# Altium project Hardware_Inventors_Course_Project.PrjPcb (part 2 of 2)

## Sheet 05_Sensors.SchDoc
size A4; SheetNumber: 5; SheetTotal: 9
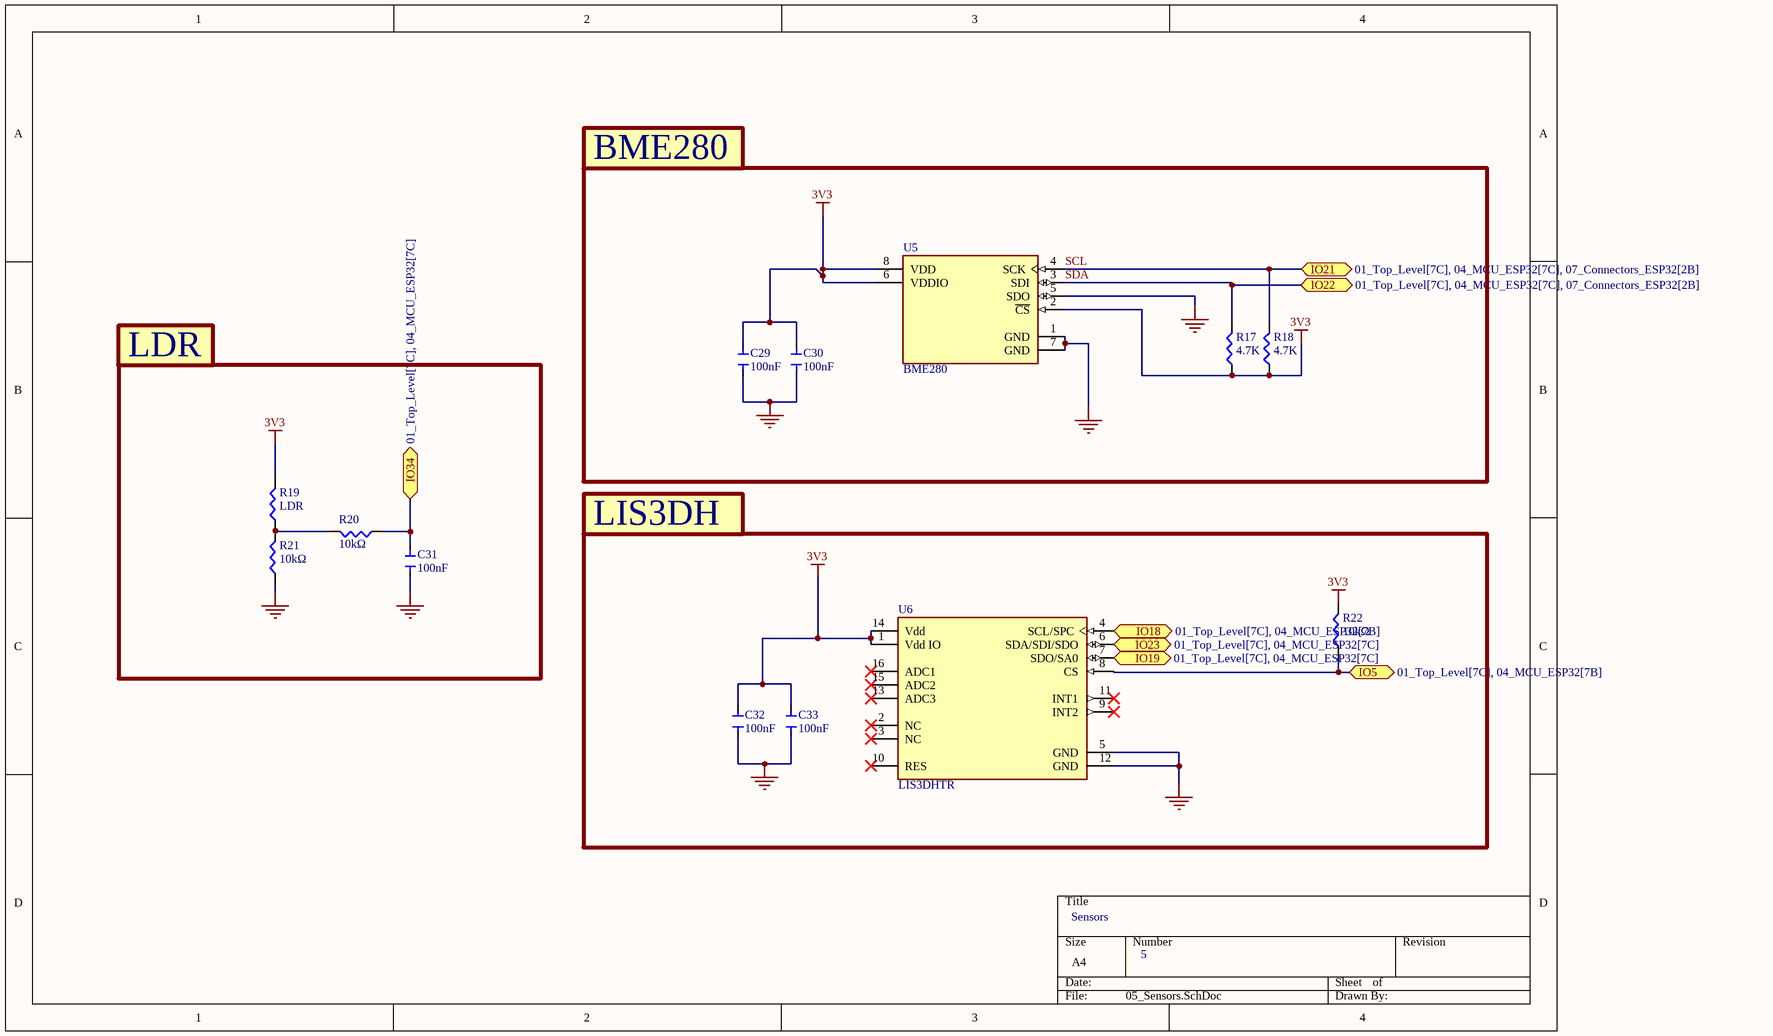
[diagram p4: 05_Sensors.SchDoc]

### Parts
C29  100nF  [CAP_100nF]
C30  100nF  [CAP_100nF]
C31  100nF  [CAP_100nF]
C32  100nF  [CAP_100nF]
C33  100nF  [CAP_100nF]
R17  4.7K  [RES_2K]
R18  4.7K  [RES_2K]
R19  LDR  [RES_2K]
R20  10kΩ  [RES_10K]
R21  10kΩ  [RES_10K]
R22  10kΩ  [RES_10K]
U5  BME280  [FP-BME280-MFG]
U6  LIS3DHTR  [FP-LGA-16-7983231-MFG]

### Blocks framed on the sheet
BME280: C29 C30 R17 R18 U5
LDR: C31 R19-R21
LIS3DH: C32 C33 R22 U6

### Ports
IO5 (bidir, see 01_Top_Level[7C], 04_MCU_ESP32[7B]), IO18 (bidir, see 01_Top_Level[7C], 04_MCU_ESP32[7B]), IO19 (bidir, see 01_Top_Level[7C], 04_MCU_ESP32[7C]), IO21 (bidir, see 01_Top_Level[7C], 04_MCU_ESP32[7C], 07_Connectors_ESP32[2B]), IO22 (bidir, see 01_Top_Level[7C], 04_MCU_ESP32[7C], 07_Connectors_ESP32[2B]), IO23 (bidir, see 01_Top_Level[7C], 04_MCU_ESP32[7C]), IO34 (bidir, see 01_Top_Level[7C], 04_MCU_ESP32[7C])

### Nets
3V3: C29.2 C30.2 C32.2 C33.2 R17.1 R18.1 R19.2 R22.2 U5.2(~{CS}) U5.6(VDDIO) U5.8(VDD) U6.1(Vdd_IO) U6.14(Vdd)
GND: C29.1 C30.1 C31.1 C32.1 C33.1 R21.1 U5.1(GND) U5.5(SDO) U5.7(GND) U6.5(GND) U6.12(GND)
SCL: R18.2 U5.4(SCK) ; port IO21
SDA: R17.2 U5.3(SDI) ; port IO22
NetC31_2: C31.2 R20.1 ; port IO34
NetMD1_29: R22.1 U6.8(CS) ; port IO5
NetMD1_30: U6.4(SCL/SPC) ; port IO18
NetMD1_31: U6.7(SDO/SA0) ; port IO19
NetMD1_37: U6.6(SDA/SDI/SDO) ; port IO23
NetR19_1: R19.1 R20.2 R21.2

Not connected (* = marked no-connect by the designer): U6 2(NC)* 3(NC)* 9(INT2)* 10(RES)* 11(INT1)* 13(ADC3)* 15(ADC2)* 16(ADC1)*

### Notes on the sheet
- Sensors
- 5

### Library data of the parts
C29-C33 = CAP_100nF: CAP 100nF 50V X7R ±10% 0603 Ceramic Capacitors RoHS; manufacturer: YAGEO; manufacturer part number: CC0603KRX7R9BB104; value: 100nf; supplier: LCSC; supplier part number: C14663; ComponentLink1Description: Datasheet; ComponentLink1URL: https://www.lcsc.com/datasheet/C14663.pdf
R17-R19 = RSE_0603_2K: 100mW 2KΩ 75V Thick Film Resistor ±100ppm/℃ ±1% 0603 Chip Resistor - Surface Mount RoHS; ComponentLink1Description: datasheet; ComponentLink1URL: https://www.lcsc.com/product-detail/C105588.html?s_z=n_resistance%2520100%2520ohm
R20-R22 = RES_0603_10K: 100mW Thin Film Resistor ±0.1% ±10ppm/℃ 10kΩ 0603 Chip Resistor - Surface Mount ROHS; Manufacturer: Yageo Group; Manufacturer Part Number: RT0603BRB07169KL; Manufacturer: YAGEO; Temperature Coefficient: 10ppm/°C; Voltage Rating: 75V; Features: Moisture Resistant; Height: 450µm; Length: 1.6002mm; Lifecycle Status: Production; Max Operating Temperature: 155°C; Max Power Dissipation: 100mW; Min Operating Temperature: -55°C; Mounting Technology: Surface Mount; Number of Terminals: 2; Number of Terminations: 2; Packaging: Tape & Reel; Power Dissipation: 100mW; Power Rating: 100mW; REACH SVHC: Yes; Tolerance: 0.1%; Width: 800µm; Working Voltage: 75V; ComponentLink1URL: https://datasheet.octopart.com:443/RT0603BRB07169KL-Yageo-datasheet-176402239.pdf?src-supplier=IHS; ComponentLink1Description: https://datasheet.octopart.com:443/RT0603BRB07169KL-Yageo-datasheet-176402239.pdf?src-supplier=IHS; ComponentLink2URL: https://datasheet.octopart.com:443/RT0603BRB07169KL-Yageo-datasheet-96443642.pdf?src-supplier=Upverter; ComponentLink2Description: https://datasheet.octopart.com:443/RT0603BRB07169KL-Yageo-datasheet-96443642.pdf?src-supplier=Upverter; ComponentLink3URL: https://datasheet.octopart.com:443/RT0603BRB07169KL-Yageo-Group-datasheet-141265893.pdf?src-supplier=ODG+(Origin+Data+Global); ComponentLink3Description: https://datasheet.octopart.com:443/RT0603BRB07169KL-Yageo-Group-datasheet-141265893.pdf?src-supplier=ODG+(Origin+Data+Global); ComponentLink4URL: https://datasheet.octopart.com/RT0603BRB07169KL-Yageo-datasheet-86813807.pdf; ComponentLink4Description: https://datasheet.octopart.com/RT0603BRB07169KL-Yageo-datasheet-86813807.pdf; ComponentLink5URL: http://sigma.octopart.com:80/conflict_mineral_statement/Yageo-company-3.pdf?src-supplier=Compliance+Statements; ComponentLink5Description: http://sigma.octopart.com:80/conflict_mineral_statement/Yageo-company-3.pdf?src-supplier=Compliance+Statements; ComponentLink6URL: http://sigma.octopart.com:80/rohs_statement/Yageo-company-2.pdf?src-supplier=Compliance+Statements; ComponentLink6Description: http://sigma.octopart.com:80/rohs_statement/Yageo-company-2.pdf?src-supplier=Compliance+Statements; Supplier: LCSC; Supplier Part Number: C860143; Datasheet Link: https://www.lcsc.com/datasheet/C860143.pdf
U5 = CMP-2000-05073-3: SENSOR PRESSURE HUMIDITY TEMP; Sensor Type: Temperature; Accuracy: 3%; Response Time: 1s; Output Type: SPI; Min Operating Temperature: -40°C; Max Operating Temperature: 85°C; Case/Package: LGA; Packaging: Cut Tape; Mount: Surface Mount; Lead Free: Lead Free; Number of Pins: 8
U6 = CMP-0234-00055-6: ACCEL 2-16G I2C/SPI 16LGA; Max Supply Voltage: 3.6V; Bandwidth: 5kHz; Min Supply Voltage (DC): 1.71V; Interface: I2C; Axis: X, Y, Z; Operating Supply Voltage: 2.5V; Operating Supply Current: 11uA; Output Type: Digital; Resolution: 16b; Sensor Type: 3 Axis; Series: -; Package Quantity: 1; Case/Package: LGA; Radiation Hardening: No; Min Operating Temperature: -40°C; Length: 3mm; Max Supply Voltage (DC): 3.6V; Lead Free: Lead Free; Height: 1mm; Number of Pins: 16; RoHS Compliant: Yes; Packaging: Tape and Reel; Width: 3mm; Contact Plating: Gold; Max Operating Temperature: 85°C; Min Supply Voltage: 1.71V; REACH SVHC: No SVHC; Depth: 3mm

## Sheet 06_Analog_and_Motor.SchDoc
size A; SheetNumber: 6; SheetTotal: 9
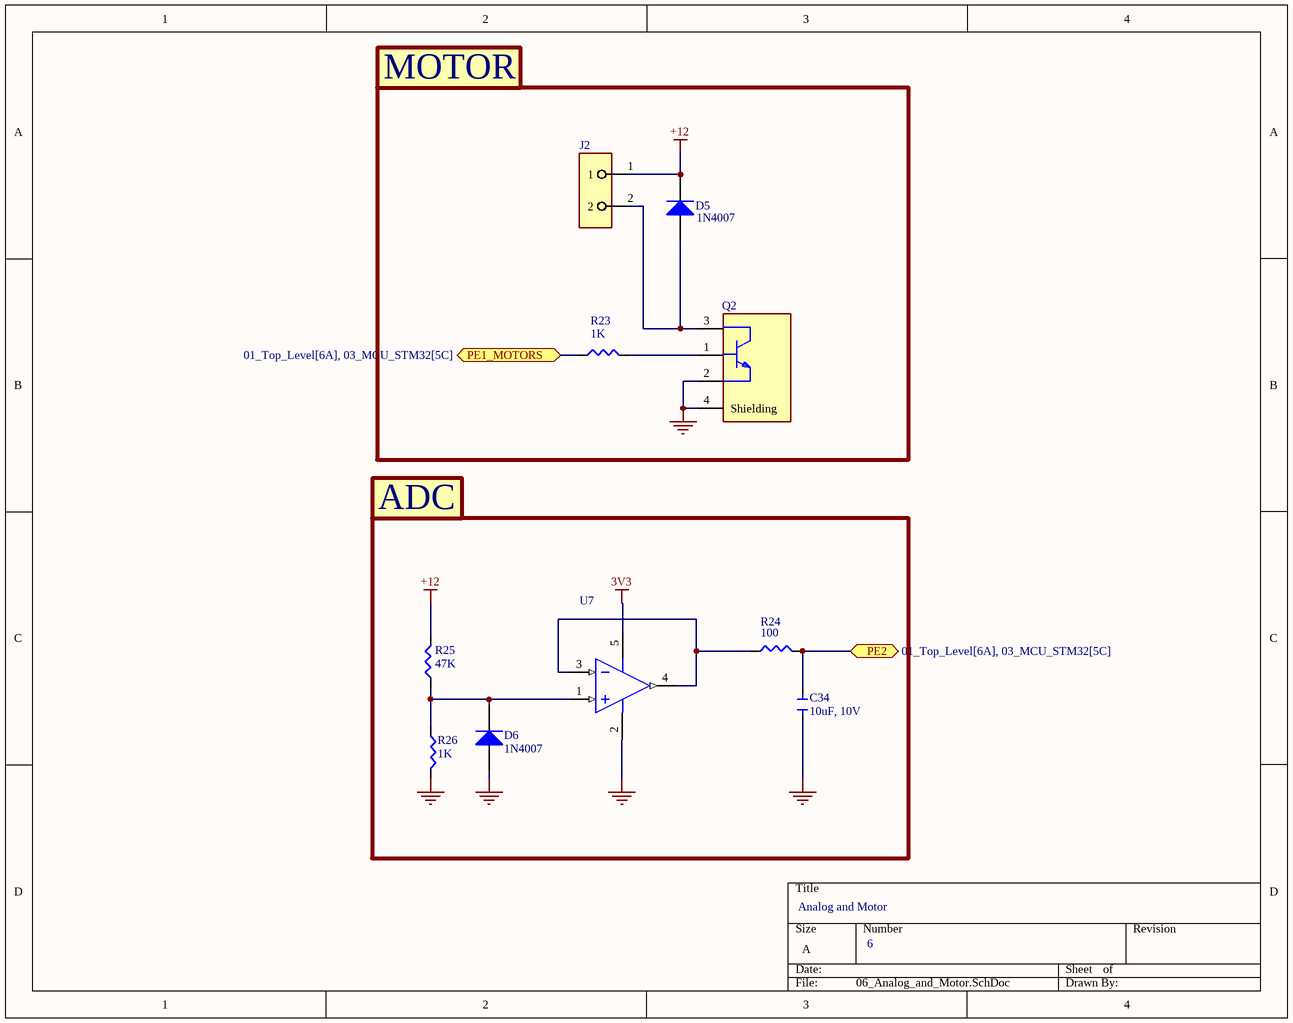
[diagram p5: 06_Analog_and_Motor.SchDoc]

### Parts
C34  10uF, 10V  [CAP_10uF]
D5  1N4007  [FAIR-DO-41-2]
D6  1N4007  [FAIR-DO-41-2]
J2  43640-0201  [FP-43640-0201-MFG]  (value not drawn)
Q2  JANTX2N2222AUB/TR  [FP-UB-IPC_A]  (value not drawn)
R23  1K  [RES_2K]
R24  100  [RES_2K]
R25  47K  [RES_2K]
R26  1K  [RES_2K]
U7  LMV321SN3T1G  [ONSC-TSOP-5-483-02_V]  (value not drawn)

### Blocks framed on the sheet
MOTOR: D5 J2 Q2 R23
ADC: C34 D6 R24-R26 U7

### Ports
PE1_MOTORS (bidir, see 01_Top_Level[6A], 03_MCU_STM32[5C]), PE2 (bidir, see 01_Top_Level[6A], 03_MCU_STM32[5C])

### Nets
3V3: U7.5(V+)
+12: D5.1(K) J2.1 R25.2
GND: C34.1 D6.2(A) Q2.2(E) Q2.4(Shielding) R26.2 U7.2(V-)
PE1_MOTORS: R23.1 ; port PE1_MOTORS
PE2: C34.2 R24.2 ; port PE2
NetD5_2: D5.2(A) J2.2 Q2.3(C)
NetD6_1: D6.1(K) R25.1 R26.1 U7.1(IN+)
NetQ2_1: Q2.1(B) R23.2
NetR24_1: R24.1 U7.3(IN-) U7.4(OUT)

### Notes on the sheet
- Analog and Motor
- 6

### Library data of the parts
C34 = CAP_0402_10UF: CAP CER 10UF 10V X5R 0402; Manufacturer: Samsung Electro-Mechanics; Manufacturer Part Number: C307415; Dielectric Material: Ceramic; Multilayer: Yes; Tolerance  (fill in as +-): 20%; Supplier: LCSC; Supplier Part Number: 1276-6830-1-ND; RoHS: Yes; Category: Ceramic Capacitors; Stock: 1294909; Pricing: 1=0.33, 10=0.215, 50=0.1584, 100=0.129, 500=0.1018, 1000=0.08597, 2500=0.08145 (USD); Mounting Technology: Surface Mount; Pins: 2; Package Shape: Rectangular; Case/Package: 0402; Terminal Finish: Nickel; Min Operating Temperature: -55°C; Max Operating Temperature: 85°C; JESD-609 Code: e3; Value: 10uF; Capacitor Type: Ceramic; Packaging: Tape and Reel; Tolerance (fill in as +-): 20%; Rated DC Voltage (URdc): 10V; Temperature Characteristics Code: X5R; Termination: Wraparound; Reach SVHC Compliant: Yes; RoHS Compliant: Yes; ComponentLink1URL: https://datasheet.ciiva.com:443/pdfs/VipMasterIC/IC/SEMS/SEMS-S-A0008521219/SEMS-S-A0008521325-1.pdf?src-supplier=IHS+Markit; ComponentLink1Description: https://datasheet.ciiva.com:443/pdfs/VipMasterIC/IC/SEMS/SEMS-S-A0008521219/SEMS-S-A0008521325-1.pdf?src-supplier=IHS+Markit; ComponentLink2URL: http://www.samsungsem.com/kr/support/product-search/mlcc/CL05A106MP8NUB8.jsp?src-supplier=Digikey; ComponentLink2Description: http://www.samsungsem.com/kr/support/product-search/mlcc/CL05A106MP8NUB8.jsp?src-supplier=Digikey; ComponentLink3URL: https://datasheet.octopart.com/CL05A106MP8NUB8-Samsung-Electro-Mechanics-datasheet-136460857.pdf?src-supplier=Future+Electronics; ComponentLink3Description: https://datasheet.octopart.com/CL05A106MP8NUB8-Samsung-Electro-Mechanics-datasheet-136460857.pdf?src-supplier=Future+Electronics; LCSC Part Number: C307415
D5 D6 = CMP-004-00007-2: General Purpose Rectifier, 1.1 V, 1.0 A, -55 to 175 degC, 2-Pin DO-41, RoHS, Tape and Reel; Manufacturer: Fairchild; Peak Reverse Current: 5uA; Max Surge Current: 30A; Elements: 1; Forward Voltage: 1.1V; Package Version: Rev. 2, 09/2008; Forward Current: 1A; Package Quantity: 5000; Packaging: TapeandReel; Package URL: http://www.fairchildsemi.com/dwg/DO/DO41A.pdf; Manufacturer URL: https://www.fairchildsemi.com/; Package Reference: DO-41-2; Pins: 2; Min Operating Temperature: -55°C; Datasheet Version: Rev. 1.1.0, 11/2014; Max Operating Temperature: 175°C; RoHS Compliant: True; Case/Package: DO-41-2; Mounting Technology: TH; Package Description: 2-Pin Axial Lead, Dia 2.375 mm, Body Length 4.63 mm; Datasheet URL: https://www.fairchildsemi.com/datasheets/1N/1N4007.pdf
J2 = CMP-04776-000134-1: CONN PLUG 2POS 3MM SINGLE ROW; Glow Wire Compliant: Non-compliant; Gender: Male; Number of Contacts: 2; Max Voltage Rating (DC): 250.25kV; Connector Type: Power; Approvals: UL; Working Voltage: 250V; Current Rating: 5A; Contact Resistance: 10mR; Body Material: Polyester; Max Operating Temperature: 105°C; Radiation Hardening: No; Min Operating Temperature: -40°C; Housing Color: Black; Lead Free: Lead Free; Contact Plating: Nickel; Pitch: 3mm; Packaging: Bulk; Voltage Rating (AC): 250V; Number of Rows: 1; Depth: 24.53mm; Mount: Cable; Package Quantity: 2500; Material: Polyester; Flammability Rating: UL94 V-0; Orientation: Straight; Operating Supply Voltage: 250V; Case/Package: 0201; Number of Poles: 2; Series: 43640; Housing Material: Polyester; Contact Gender: Male; Contact Material: Bronze; Termination: Crimp; Length: 6.85mm; Height: 3.86mm; Color: Black; Number of Positions: 2
Q2 = CMP-00252-101463705-1: JANTX2N2222AUB/TR Trans Gp Bjt NPN 50V 0.8A 3-PIN Ub T/r; hFE Min: 100; Collector Emitter Saturation Voltage: 300mV; Max Collector Current: 800mA; Max Junction Temperature (Tj): 200°C; Number of Elements: 1; Power Dissipation: 500mW; Collector Base Voltage (VCBO): 75V; Emitter Base Voltage (VEBO): 6V; Mount: Surface Mount; Polarity: NPN; Max Operating Temperature: 200°C; Number of Pins: 3; NexarPartId: 101463705; Height: 1.8mm; Schedule B: 8541290040; Radiation Hardening: No; Collector Emitter Voltage (VCEO): 50V; Min Operating Temperature: -65°C; Collector Emitter Breakdown Voltage: 50V; RoHS: Non-Compliant; Max Power Dissipation: 500mW
R23-R26 = RSE_0603_2K: as R17 on sheet 05_Sensors; ComponentLink1Description: datasheet; ComponentLink1URL: https://www.lcsc.com/product-detail/C105588.html?s_z=n_resistance%2520100%2520ohm
U7 = CMP-1310-00382-1: Single Low-Voltage, Rail-to-Rail Operational Amplifier, 2.7 to 5.5 V, -40 to 85 degC, 5-Pin TSOP, Pb-Free, Tape and Reel; Manufacturer: On Semiconductor; SR Typ (V/uS): 1; VCC Min (V): 2.7; VCC Max (V): 5.5; DatasheetVersion: Rev. 10; ComponentLink3Description: Package Specification; PackageDescription: 5-Pin Small Outline Package, Body 3 x 1.5 mm, Pitch 0.95 mm; ComponentLink1Description: Manufacturer URL; ComponentLink2URL: http://www.onsemi.cn/pub_link/Collateral/LMV321-LMV358-LMV324-D.PDF; GBW Typ (MHz): 1; ComponentLink3URL: http://www.onsemi.com/pub_link/Collateral/483.PDF; RoHS: TRUE; Packing: Tape and Reel; ComponentLink2Description: Datasheet; PackageReference: TSOP-5-483-02; ComponentLink1URL: http://www.onsemi.com/; PackageVersion: Rev. K, 04/2013; Mounting Technology: Surface Mount; PartNumber: LMV321SN3T1G

## Sheet 07_Connectors_ESP32.SchDoc
size A4; SheetNumber: 7; SheetTotal: 9
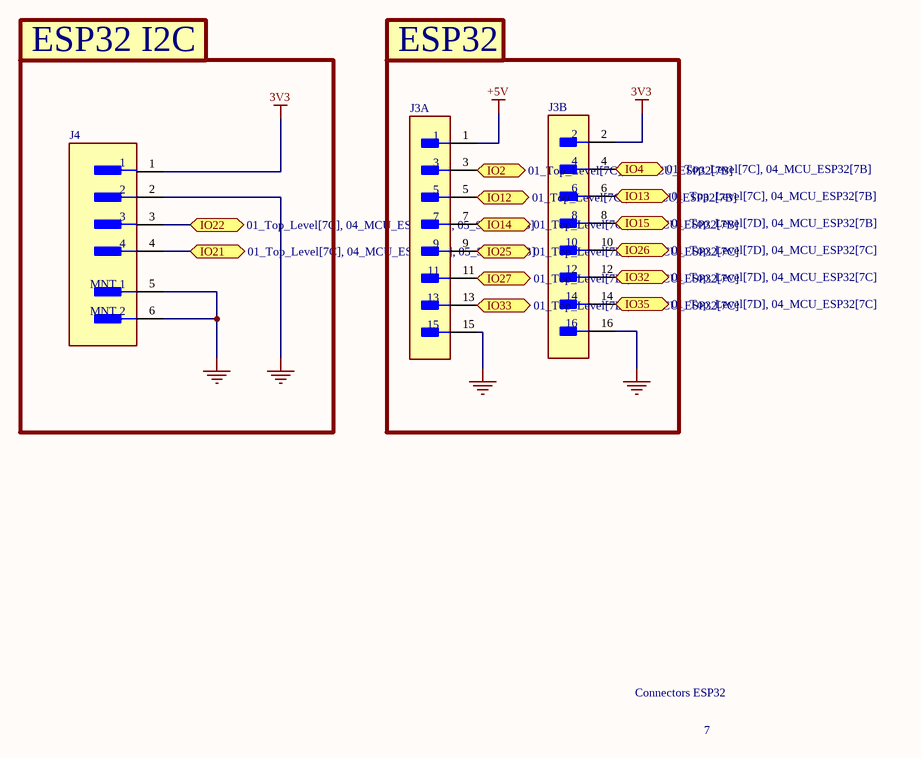
[diagram p6: 07_Connectors_ESP32.SchDoc]

### Parts
J3  GRPB082MWCN-RC  [FP-GRPB082MWCN-RC-MFG]  (value not drawn)  (parts A,B of 2)
J4  533980471  [FP-533980471-MFG]  (value not drawn)

### Blocks framed on the sheet
ESP32 I2C: J4
ESP32: J3

### Ports
IO2 (bidir, see 01_Top_Level[7C], 04_MCU_ESP32[7B]), IO4 (bidir, see 01_Top_Level[7C], 04_MCU_ESP32[7B]), IO12 (bidir, see 01_Top_Level[7C], 04_MCU_ESP32[7B]), IO13 (bidir, see 01_Top_Level[7C], 04_MCU_ESP32[7B]), IO14 (bidir, see 01_Top_Level[7C], 04_MCU_ESP32[7B]), IO15 (bidir, see 01_Top_Level[7D], 04_MCU_ESP32[7B]), IO21 (bidir, see 01_Top_Level[7C], 04_MCU_ESP32[7C], 05_Sensors[4B]), IO22 (bidir, see 01_Top_Level[7C], 04_MCU_ESP32[7C], 05_Sensors[4B]), IO25 (bidir, see 01_Top_Level[7D], 04_MCU_ESP32[7C]), IO26 (bidir, see 01_Top_Level[7D], 04_MCU_ESP32[7C]), IO27 (bidir, see 01_Top_Level[7D], 04_MCU_ESP32[7C]), IO32 (bidir, see 01_Top_Level[7D], 04_MCU_ESP32[7C]), IO33 (bidir, see 01_Top_Level[7D], 04_MCU_ESP32[7C]), IO35 (bidir, see 01_Top_Level[7D], 04_MCU_ESP32[7C])

### Nets
3V3: J3.2 J4.1
+5V: J3.1
GND: J3.15 J3.16 J4.2 J4.5(MNT_1) J4.6(MNT_2)
SCL: J4.4 ; port IO21
SDA: J4.3 ; port IO22
NetJ3_3: J3.3 ; port IO2
NetJ3_4: J3.4 ; port IO4
NetJ3_5: J3.5 ; port IO12
NetJ3_6: J3.6 ; port IO13
NetJ3_7: J3.7 ; port IO14
NetJ3_8: J3.8 ; port IO15
NetJ3_9: J3.9 ; port IO25
NetJ3_10: J3.10 ; port IO26
NetJ3_11: J3.11 ; port IO27
NetJ3_12: J3.12 ; port IO32
NetJ3_13: J3.13 ; port IO33
NetJ3_14: J3.14 ; port IO35

### Notes on the sheet
- Connectors ESP32
- 7

### Library data of the parts
J3 = CMP-25680-000081-1: CONN HEADER R/A 16POS 1.27MM; Number of Positions: 16; Row Spacing: 0.05inch; Max Operating Temperature: 105°C; Flammability Rating: UL94 V-0; Contact Type: Male Pin; Termination: Solder; Contact Material: Brass; Package Quantity: 1; Lead Free: Lead Free; Min Operating Temperature: -40°C; Contact Shape: Square; Insulation Material: Nylon; Contact Plating: Gold; Connector Type: Header; Mount: Through Hole; Pitch: 1.27mm; RoHS Compliant: Yes; Fastening Type: Pull; Number of Rows: 2; Contact Mating Length: 0.118inch; Series: -; Packaging: Bulk; Contact Finish - Mating: GOLD
J4 = CMP-04776-000105-1: CONN HEADER SMD 4POS 1.25MM; Manufacturer: Molex; Conn Gender: Male; Description: Connector Header Surface Mount 4 position 0.049" (1.25mm); Conn Orientation: Vertical; Standoff Height: 0.05mm; Number Of Contacts: 4; Current Rating: 1A; Voltage Rating: 125V; Package: 0; ComponentLink2Description: Datasheet; ComponentLink2URL: https://www.molex.com/pdm_docs/ps/PS-51021-024-001.pdf; Ambient Temperature Range Low: -40°C; Category: Conn; Automotive: No; Number Of Rows: 1; Device Class L3: unset; Ambient Temperature Range High: +105°C; Height: 5.1mm; Lead Free: Yes; Pitch: 1.25mm; Contact Material: Tin; Footprint Url: https://www.molex.com/pdm_docs/sd/533980471_sd.pdf; Octopart: https://octopart.com/53398-0471-molex-655296; Temperature Range Low: -40°C; Device Class L2: Headers and Wire Housings; Temperature: -40°C to +105°C; Digikey Description: CONN HEADER SMD 4POS 1.25MM; RoHS: TRUE; Manufacturer Part Number: 533980471; Device Class L1: Connectors; Temperature Range High: +105°C

## Sheet 08_Connectors_STM32_A.SchDoc
size A; SheetNumber: 8; SheetTotal: 9
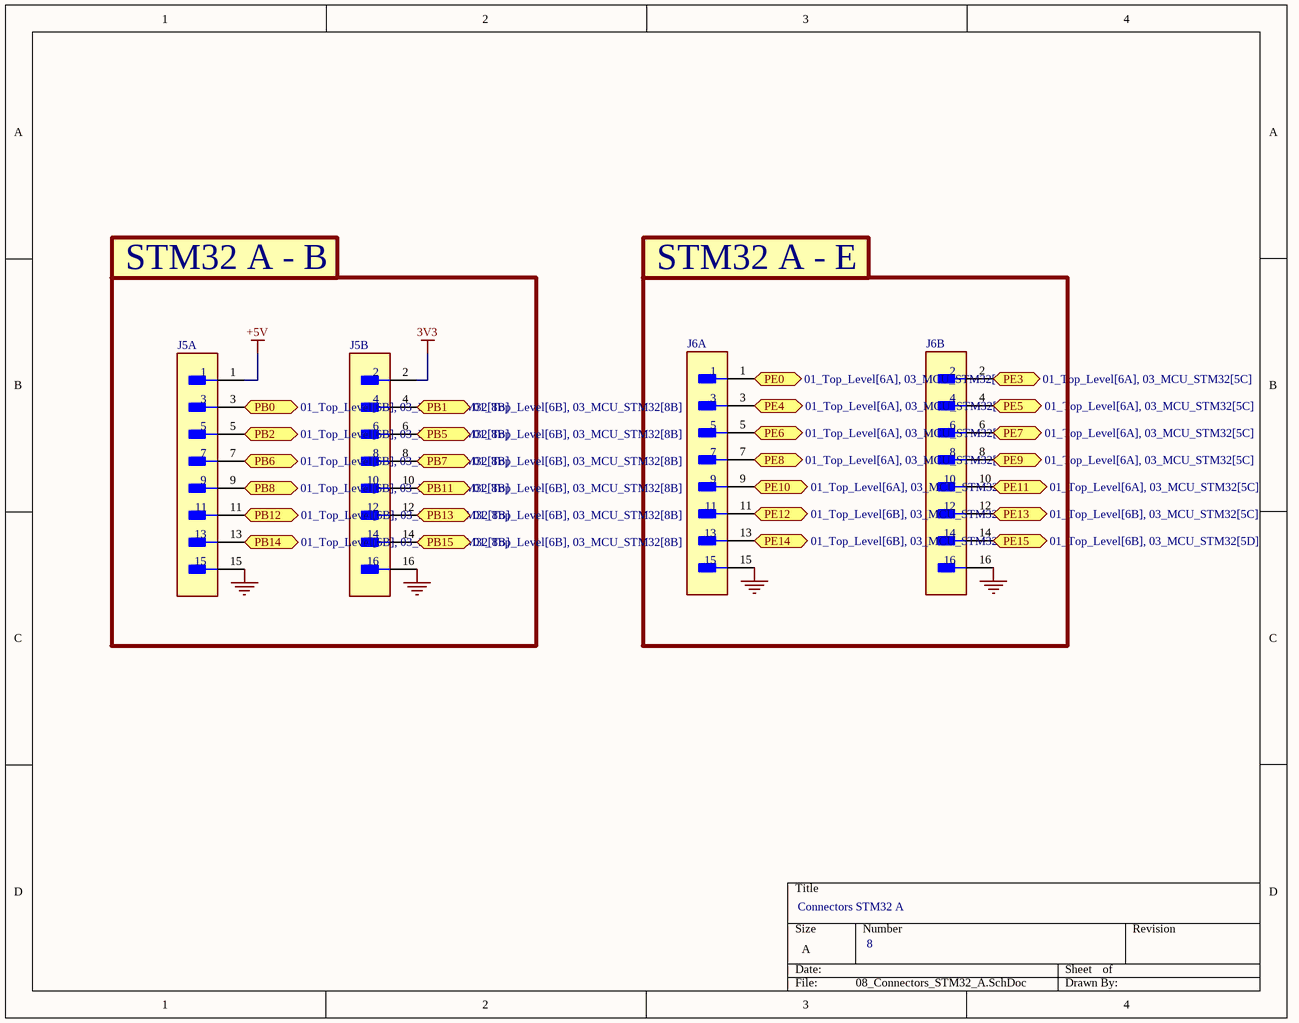
[diagram p7: 08_Connectors_STM32_A.SchDoc]

### Parts
J5  GRPB082MWCN-RC  [FP-GRPB082MWCN-RC-MFG]  (value not drawn)  (parts A,B of 2)
J6  GRPB082MWCN-RC  [FP-GRPB082MWCN-RC-MFG]  (value not drawn)  (parts A,B of 2)

### Blocks framed on the sheet
STM32 A - B: J5
STM32 A - E: J6

### Ports
PB0 (bidir, see 01_Top_Level[6B], 03_MCU_STM32[8B]), PB1 (bidir, see 01_Top_Level[6B], 03_MCU_STM32[8B]), PB2 (bidir, see 01_Top_Level[6B], 03_MCU_STM32[8B]), PB5 (bidir, see 01_Top_Level[6B], 03_MCU_STM32[8B]), PB6 (bidir, see 01_Top_Level[6B], 03_MCU_STM32[8B]), PB7 (bidir, see 01_Top_Level[6B], 03_MCU_STM32[8B]), PB8 (bidir, see 01_Top_Level[6B], 03_MCU_STM32[8B]), PB11 (bidir, see 01_Top_Level[6B], 03_MCU_STM32[8B]), PB12 (bidir, see 01_Top_Level[6B], 03_MCU_STM32[8B]), PB13 (bidir, see 01_Top_Level[6B], 03_MCU_STM32[8B]), PB14 (bidir, see 01_Top_Level[6B], 03_MCU_STM32[8B]), PB15 (bidir, see 01_Top_Level[6B], 03_MCU_STM32[8B]), PE0 (bidir, see 01_Top_Level[6A], 03_MCU_STM32[5C]), PE3 (bidir, see 01_Top_Level[6A], 03_MCU_STM32[5C]), PE4 (bidir, see 01_Top_Level[6A], 03_MCU_STM32[5C]), PE5 (bidir, see 01_Top_Level[6A], 03_MCU_STM32[5C]), PE6 (bidir, see 01_Top_Level[6A], 03_MCU_STM32[5C]), PE7 (bidir, see 01_Top_Level[6A], 03_MCU_STM32[5C]), PE8 (bidir, see 01_Top_Level[6A], 03_MCU_STM32[5C]), PE9 (bidir, see 01_Top_Level[6A], 03_MCU_STM32[5C]), PE10 (bidir, see 01_Top_Level[6A], 03_MCU_STM32[5C]), PE11 (bidir, see 01_Top_Level[6A], 03_MCU_STM32[5C]), PE12 (bidir, see 01_Top_Level[6B], 03_MCU_STM32[5C]), PE13 (bidir, see 01_Top_Level[6B], 03_MCU_STM32[5C]), PE14 (bidir, see 01_Top_Level[6B], 03_MCU_STM32[5C]), PE15 (bidir, see 01_Top_Level[6B], 03_MCU_STM32[5D])

### Nets
3V3: J5.2
+5V: J5.1
GND: J5.15 J5.16 J6.15 J6.16
PB0: J5.3 ; port PB0
PB1: J5.4 ; port PB1
PB2: J5.5 ; port PB2
PB5: J5.6 ; port PB5
PB6: J5.7 ; port PB6
PB7: J5.8 ; port PB7
PB8: J5.9 ; port PB8
PB11: J5.10 ; port PB11
PB12: J5.11 ; port PB12
PB13: J5.12 ; port PB13
PB14: J5.13 ; port PB14
PB15: J5.14 ; port PB15
PE0: J6.1 ; port PE0
PE3: J6.2 ; port PE3
PE4: J6.3 ; port PE4
PE5: J6.4 ; port PE5
PE6: J6.5 ; port PE6
PE7: J6.6 ; port PE7
PE8: J6.7 ; port PE8
PE9: J6.8 ; port PE9
PE10: J6.9 ; port PE10
PE11: J6.10 ; port PE11
PE12: J6.11 ; port PE12
PE13: J6.12 ; port PE13
PE14: J6.13 ; port PE14
PE15: J6.14 ; port PE15

### Notes on the sheet
- Connectors STM32 A
- 8

### Library data of the parts
J5 J6 = CMP-25680-000081-1: as J3 on sheet 07_Connectors_ESP32; Max Operating Temperature: 105°C; Flammability Rating: UL94 V-0; Contact Type: Male Pin; Termination: Solder; Contact Material: Brass; Package Quantity: 1; Lead Free: Lead Free; Min Operating Temperature: -40°C; Contact Shape: Square; Insulation Material: Nylon; Contact Plating: Gold; Connector Type: Header; Mount: Through Hole; Pitch: 1.27mm; RoHS Compliant: Yes; Fastening Type: Pull; Number of Rows: 2; Contact Mating Length: 0.118inch; Series: -; Packaging: Bulk; Contact Finish - Mating: GOLD

## Sheet 09_Connectors_STM32_B.SchDoc
size Letter; SheetNumber: 9; SheetTotal: 9
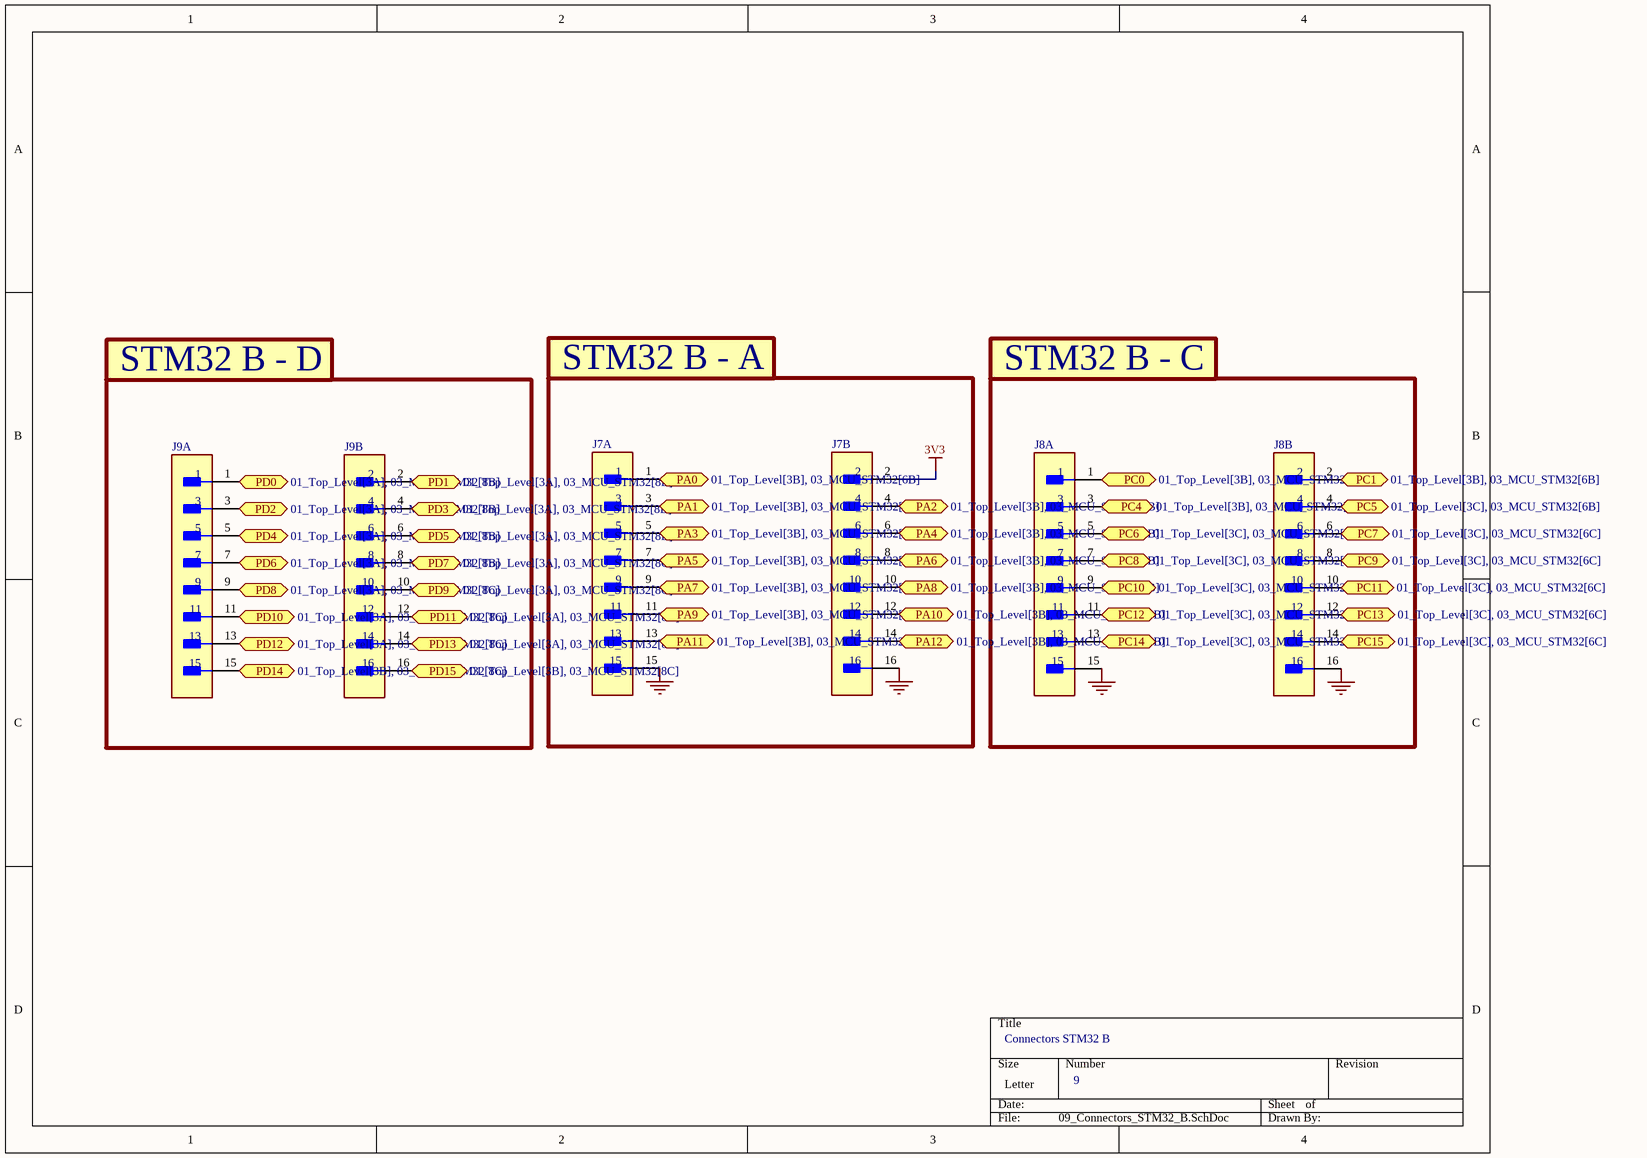
[diagram p8: 09_Connectors_STM32_B.SchDoc]

### Parts
J7  GRPB082MWCN-RC  [FP-GRPB082MWCN-RC-MFG]  (value not drawn)  (parts A,B of 2)
J8  GRPB082MWCN-RC  [FP-GRPB082MWCN-RC-MFG]  (value not drawn)  (parts A,B of 2)
J9  GRPB082MWCN-RC  [FP-GRPB082MWCN-RC-MFG]  (value not drawn)  (parts A,B of 2)

### Blocks framed on the sheet
STM32 B - D: J9
STM32 B - A: J7
STM32 B - C: J8

### Ports
PA0 (bidir, see 01_Top_Level[3B], 03_MCU_STM32[6B]), PA1 (bidir, see 01_Top_Level[3B], 03_MCU_STM32[6B]), PA2 (bidir, see 01_Top_Level[3B], 03_MCU_STM32[6B]), PA3 (bidir, see 01_Top_Level[3B], 03_MCU_STM32[6B]), PA4 (bidir, see 01_Top_Level[3B], 03_MCU_STM32[6B]), PA5 (bidir, see 01_Top_Level[3B], 03_MCU_STM32[6B]), PA6 (bidir, see 01_Top_Level[3B], 03_MCU_STM32[6B]), PA7 (bidir, see 01_Top_Level[3B], 03_MCU_STM32[6B]), PA8 (bidir, see 01_Top_Level[3B], 03_MCU_STM32[6B]), PA9 (bidir, see 01_Top_Level[3B], 03_MCU_STM32[6B]), PA10 (bidir, see 01_Top_Level[3B], 03_MCU_STM32[6B]), PA11 (bidir, see 01_Top_Level[3B], 03_MCU_STM32[6B]), PA12 (bidir, see 01_Top_Level[3B], 03_MCU_STM32[6B]), PC0 (bidir, see 01_Top_Level[3B], 03_MCU_STM32[6B]), PC1 (bidir, see 01_Top_Level[3B], 03_MCU_STM32[6B]), PC4 (bidir, see 01_Top_Level[3B], 03_MCU_STM32[6B]), PC5 (bidir, see 01_Top_Level[3C], 03_MCU_STM32[6B]), PC6 (bidir, see 01_Top_Level[3C], 03_MCU_STM32[6B]), PC7 (bidir, see 01_Top_Level[3C], 03_MCU_STM32[6C]), PC8 (bidir, see 01_Top_Level[3C], 03_MCU_STM32[6C]), PC9 (bidir, see 01_Top_Level[3C], 03_MCU_STM32[6C]), PC10 (bidir, see 01_Top_Level[3C], 03_MCU_STM32[6C]), PC11 (bidir, see 01_Top_Level[3C], 03_MCU_STM32[6C]), PC12 (bidir, see 01_Top_Level[3C], 03_MCU_STM32[6C]), PC13 (bidir, see 01_Top_Level[3C], 03_MCU_STM32[6C]), PC14 (bidir, see 01_Top_Level[3C], 03_MCU_STM32[6C]), PC15 (bidir, see 01_Top_Level[3C], 03_MCU_STM32[6C]), PD0 (bidir, see 01_Top_Level[3A], 03_MCU_STM32[8B]), PD1 (bidir, see 01_Top_Level[3A], 03_MCU_STM32[8B]), PD2 (bidir, see 01_Top_Level[3A], 03_MCU_STM32[8B]), PD3 (bidir, see 01_Top_Level[3A], 03_MCU_STM32[8B]), PD4 (bidir, see 01_Top_Level[3A], 03_MCU_STM32[8B]), PD5 (bidir, see 01_Top_Level[3A], 03_MCU_STM32[8B]), PD6 (bidir, see 01_Top_Level[3A], 03_MCU_STM32[8B]), PD7 (bidir, see 01_Top_Level[3A], 03_MCU_STM32[8C]), PD8 (bidir, see 01_Top_Level[3A], 03_MCU_STM32[8C]), PD9 (bidir, see 01_Top_Level[3A], 03_MCU_STM32[8C]), PD10 (bidir, see 01_Top_Level[3A], 03_MCU_STM32[8C]), PD11 (bidir, see 01_Top_Level[3A], 03_MCU_STM32[8C]), PD12 (bidir, see 01_Top_Level[3A], 03_MCU_STM32[8C]), PD13 (bidir, see 01_Top_Level[3A], 03_MCU_STM32[8C]), PD14 (bidir, see 01_Top_Level[3B], 03_MCU_STM32[8C]), PD15 (bidir, see 01_Top_Level[3B], 03_MCU_STM32[8C])

### Nets
3V3: J7.2
GND: J7.15 J7.16 J8.15 J8.16
PA0: J7.1 ; port PA0
PA1: J7.3 ; port PA1
PA2: J7.4 ; port PA2
PA3: J7.5 ; port PA3
PA4: J7.6 ; port PA4
PA5: J7.7 ; port PA5
PA6: J7.8 ; port PA6
PA7: J7.9 ; port PA7
PA8: J7.10 ; port PA8
PA9: J7.11 ; port PA9
PA10: J7.12 ; port PA10
PA11: J7.13 ; port PA11
PA12: J7.14 ; port PA12
PC0: J8.1 ; port PC0
PC1: J8.2 ; port PC1
PC4: J8.3 ; port PC4
PC5: J8.4 ; port PC5
PC6: J8.5 ; port PC6
PC7: J8.6 ; port PC7
PC8: J8.7 ; port PC8
PC9: J8.8 ; port PC9
PC10: J8.9 ; port PC10
PC11: J8.10 ; port PC11
PC12: J8.11 ; port PC12
PC13: J8.12 ; port PC13
PC14: J8.13 ; port PC14
PC15: J8.14 ; port PC15
PD0: J9.1 ; port PD0
PD1: J9.2 ; port PD1
PD2: J9.3 ; port PD2
PD3: J9.4 ; port PD3
PD4: J9.5 ; port PD4
PD5: J9.6 ; port PD5
PD6: J9.7 ; port PD6
PD7: J9.8 ; port PD7
PD8: J9.9 ; port PD8
PD9: J9.10 ; port PD9
PD10: J9.11 ; port PD10
PD11: J9.12 ; port PD11
PD12: J9.13 ; port PD12
PD13: J9.14 ; port PD13
PD14: J9.15 ; port PD14
PD15: J9.16 ; port PD15

### Notes on the sheet
- Connectors STM32 B
- 9

### Library data of the parts
J7-J9 = CMP-25680-000081-1: as J3 on sheet 07_Connectors_ESP32; Max Operating Temperature: 105°C; Flammability Rating: UL94 V-0; Contact Type: Male Pin; Termination: Solder; Contact Material: Brass; Package Quantity: 1; Lead Free: Lead Free; Min Operating Temperature: -40°C; Contact Shape: Square; Insulation Material: Nylon; Contact Plating: Gold; Connector Type: Header; Mount: Through Hole; Pitch: 1.27mm; RoHS Compliant: Yes; Fastening Type: Pull; Number of Rows: 2; Contact Mating Length: 0.118inch; Series: -; Packaging: Bulk; Contact Finish - Mating: GOLD

## Nets that join several sheets
3V3: 03_MCU_STM32 (12 pins), 02_Power_Supply (C7.2 R6.2 R7.2), 04_MCU_ESP32 (11 pins), 05_Sensors (13 pins), 06_Analog_and_Motor (U7.5), 07_Connectors_ESP32 (J3.2 J4.1), 08_Connectors_STM32_A (J5.2), 09_Connectors_STM32_B (J7.2)
+5V: 02_Power_Supply (C3.2 R2.2 R3.2), 07_Connectors_ESP32 (J3.1), 08_Connectors_STM32_A (J5.1)
+12: 02_Power_Supply (16 pins), 06_Analog_and_Motor (D5.1 J2.1 R25.2)
GND: 03_MCU_STM32 (34 pins), 02_Power_Supply (24 pins), 04_MCU_ESP32 (17 pins), 05_Sensors (11 pins), 06_Analog_and_Motor (6 pins), 07_Connectors_ESP32 (5 pins), 08_Connectors_STM32_A (J5.15 J5.16 J6.15 J6.16), 09_Connectors_STM32_B (J7.15 J7.16 J8.15 J8.16)
NetC31_2: 04_MCU_ESP32 (MD1.6), 05_Sensors (C31.2 R20.1)
NetJ3_3: 04_MCU_ESP32 (MD1.24), 07_Connectors_ESP32 (J3.3)
NetJ3_4: 04_MCU_ESP32 (MD1.26), 07_Connectors_ESP32 (J3.4)
NetJ3_5: 04_MCU_ESP32 (MD1.14), 07_Connectors_ESP32 (J3.5)
NetJ3_6: 04_MCU_ESP32 (MD1.16), 07_Connectors_ESP32 (J3.6)
NetJ3_7: 04_MCU_ESP32 (MD1.13), 07_Connectors_ESP32 (J3.7)
NetJ3_8: 04_MCU_ESP32 (MD1.23), 07_Connectors_ESP32 (J3.8)
NetJ3_9: 04_MCU_ESP32 (MD1.10), 07_Connectors_ESP32 (J3.9)
NetJ3_10: 04_MCU_ESP32 (MD1.11), 07_Connectors_ESP32 (J3.10)
NetJ3_11: 04_MCU_ESP32 (MD1.12), 07_Connectors_ESP32 (J3.11)
NetJ3_12: 04_MCU_ESP32 (MD1.8), 07_Connectors_ESP32 (J3.12)
NetJ3_13: 04_MCU_ESP32 (MD1.9), 07_Connectors_ESP32 (J3.13)
NetJ3_14: 04_MCU_ESP32 (MD1.7), 07_Connectors_ESP32 (J3.14)
NetMD1_29: 04_MCU_ESP32 (MD1.29), 05_Sensors (R22.1 U6.8)
NetMD1_30: 04_MCU_ESP32 (MD1.30), 05_Sensors (U6.4)
NetMD1_31: 04_MCU_ESP32 (MD1.31), 05_Sensors (U6.7)
NetMD1_37: 04_MCU_ESP32 (MD1.37), 05_Sensors (U6.6)
PA0: 03_MCU_STM32 (U4.23), 09_Connectors_STM32_B (J7.1)
PA1: 03_MCU_STM32 (U4.24), 09_Connectors_STM32_B (J7.3)
PA2: 03_MCU_STM32 (U4.25), 04_MCU_ESP32 (MD1.28), 09_Connectors_STM32_B (J7.4)
PA3: 03_MCU_STM32 (U4.26), 04_MCU_ESP32 (MD1.27), 09_Connectors_STM32_B (J7.5)
PA4: 03_MCU_STM32 (U4.29), 09_Connectors_STM32_B (J7.6)
PA5: 03_MCU_STM32 (U4.30), 09_Connectors_STM32_B (J7.7)
PA6: 03_MCU_STM32 (U4.31), 09_Connectors_STM32_B (J7.8)
PA7: 03_MCU_STM32 (U4.32), 09_Connectors_STM32_B (J7.9)
PA8: 03_MCU_STM32 (U4.67), 09_Connectors_STM32_B (J7.10)
PA9: 03_MCU_STM32 (U4.68), 09_Connectors_STM32_B (J7.11)
PA10: 03_MCU_STM32 (U4.69), 09_Connectors_STM32_B (J7.12)
PA11: 03_MCU_STM32 (U4.70), 09_Connectors_STM32_B (J7.13)
PA12: 03_MCU_STM32 (U4.71), 09_Connectors_STM32_B (J7.14)
PB0: 03_MCU_STM32 (U4.35), 08_Connectors_STM32_A (J5.3)
PB1: 03_MCU_STM32 (U4.36), 08_Connectors_STM32_A (J5.4)
PB2: 03_MCU_STM32 (U4.37), 08_Connectors_STM32_A (J5.5)
PB5: 03_MCU_STM32 (U4.91), 08_Connectors_STM32_A (J5.6)
PB6: 03_MCU_STM32 (U4.92), 08_Connectors_STM32_A (J5.7)
PB7: 03_MCU_STM32 (U4.93), 08_Connectors_STM32_A (J5.8)
PB8: 03_MCU_STM32 (U4.95), 08_Connectors_STM32_A (J5.9)
PB11: 03_MCU_STM32 (U4.48), 08_Connectors_STM32_A (J5.10)
PB12: 03_MCU_STM32 (U4.51), 08_Connectors_STM32_A (J5.11)
PB13: 03_MCU_STM32 (U4.52), 08_Connectors_STM32_A (J5.12)
PB14: 03_MCU_STM32 (U4.53), 08_Connectors_STM32_A (J5.13)
PB15: 03_MCU_STM32 (U4.54), 08_Connectors_STM32_A (J5.14)
PC0: 03_MCU_STM32 (U4.15), 09_Connectors_STM32_B (J8.1)
PC1: 03_MCU_STM32 (U4.16), 09_Connectors_STM32_B (J8.2)
PC4: 03_MCU_STM32 (U4.33), 09_Connectors_STM32_B (J8.3)
PC5: 03_MCU_STM32 (U4.34), 09_Connectors_STM32_B (J8.4)
PC6: 03_MCU_STM32 (U4.63), 09_Connectors_STM32_B (J8.5)
PC7: 03_MCU_STM32 (U4.64), 09_Connectors_STM32_B (J8.6)
PC8: 03_MCU_STM32 (U4.65), 09_Connectors_STM32_B (J8.7)
PC9: 03_MCU_STM32 (U4.66), 09_Connectors_STM32_B (J8.8)
PC10: 03_MCU_STM32 (U4.78), 09_Connectors_STM32_B (J8.9)
PC11: 03_MCU_STM32 (U4.79), 09_Connectors_STM32_B (J8.10)
PC12: 03_MCU_STM32 (U4.80), 09_Connectors_STM32_B (J8.11)
PC13: 03_MCU_STM32 (U4.7), 09_Connectors_STM32_B (J8.12)
PC14: 03_MCU_STM32 (U4.8), 09_Connectors_STM32_B (J8.13)
PC15: 03_MCU_STM32 (U4.9), 09_Connectors_STM32_B (J8.14)
PD0: 03_MCU_STM32 (U4.81), 09_Connectors_STM32_B (J9.1)
PD1: 03_MCU_STM32 (U4.82), 09_Connectors_STM32_B (J9.2)
PD2: 03_MCU_STM32 (U4.83), 09_Connectors_STM32_B (J9.3)
PD3: 03_MCU_STM32 (U4.84), 09_Connectors_STM32_B (J9.4)
PD4: 03_MCU_STM32 (U4.85), 09_Connectors_STM32_B (J9.5)
PD5: 03_MCU_STM32 (U4.86), 09_Connectors_STM32_B (J9.6)
PD6: 03_MCU_STM32 (U4.87), 09_Connectors_STM32_B (J9.7)
PD7: 03_MCU_STM32 (U4.88), 09_Connectors_STM32_B (J9.8)
PD8: 03_MCU_STM32 (U4.55), 09_Connectors_STM32_B (J9.9)
PD9: 03_MCU_STM32 (U4.56), 09_Connectors_STM32_B (J9.10)
PD10: 03_MCU_STM32 (U4.57), 09_Connectors_STM32_B (J9.11)
PD11: 03_MCU_STM32 (U4.58), 09_Connectors_STM32_B (J9.12)
PD12: 03_MCU_STM32 (U4.59), 09_Connectors_STM32_B (J9.13)
PD13: 03_MCU_STM32 (U4.60), 09_Connectors_STM32_B (J9.14)
PD14: 03_MCU_STM32 (U4.61), 09_Connectors_STM32_B (J9.15)
PD15: 03_MCU_STM32 (U4.62), 09_Connectors_STM32_B (J9.16)
PE0: 03_MCU_STM32 (U4.97), 08_Connectors_STM32_A (J6.1)
PE1_MOTORS: 03_MCU_STM32 (U4.98), 06_Analog_and_Motor (R23.1)
PE2: 03_MCU_STM32 (R13.2 U4.1), 06_Analog_and_Motor (C34.2 R24.2)
PE3: 03_MCU_STM32 (U4.2), 08_Connectors_STM32_A (J6.2)
PE4: 03_MCU_STM32 (U4.3), 08_Connectors_STM32_A (J6.3)
PE5: 03_MCU_STM32 (U4.4), 08_Connectors_STM32_A (J6.4)
PE6: 03_MCU_STM32 (U4.5), 08_Connectors_STM32_A (J6.5)
PE7: 03_MCU_STM32 (U4.38), 08_Connectors_STM32_A (J6.6)
PE8: 03_MCU_STM32 (U4.39), 08_Connectors_STM32_A (J6.7)
PE9: 03_MCU_STM32 (U4.40), 08_Connectors_STM32_A (J6.8)
PE10: 03_MCU_STM32 (U4.41), 08_Connectors_STM32_A (J6.9)
PE11: 03_MCU_STM32 (U4.42), 08_Connectors_STM32_A (J6.10)
PE12: 03_MCU_STM32 (U4.43), 08_Connectors_STM32_A (J6.11)
PE13: 03_MCU_STM32 (U4.44), 08_Connectors_STM32_A (J6.12)
PE14: 03_MCU_STM32 (U4.45), 08_Connectors_STM32_A (J6.13)
PE15: 03_MCU_STM32 (U4.46), 08_Connectors_STM32_A (J6.14)
SCL: 04_MCU_ESP32 (MD1.33), 05_Sensors (R18.2 U5.4), 07_Connectors_ESP32 (J4.4)
SDA: 04_MCU_ESP32 (MD1.36), 05_Sensors (R17.2 U5.3), 07_Connectors_ESP32 (J4.3)